# Altium schematic sheet Sheet1.SchDoc
size A
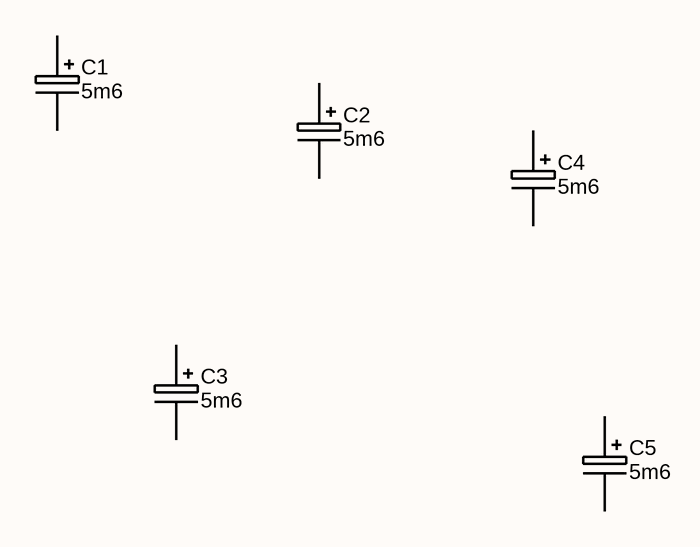
[diagram p0: Sheet1.SchDoc]

## Parts
C1  5m6  [CAPE10.0MM_Rad_30x45mm]
C2  5m6  [CAPE10.0MM_Rad_30x45mm]
C3  5m6  [CAPE10.0MM_Rad_30x45mm]
C4  5m6  [CAPE10.0MM_Rad_30x45mm]
C5  5m6  [CAPE10.0MM_Rad_30x45mm]

## Nets

Not connected (* = marked no-connect by the designer): C1 1 2; C2 1 2; C3 1 2; C4 1 2; C5 1 2

## Library data of the parts
C1-C5 = CAPE_5m6_THT_80V: Capacitor THT Electrolytic 5600uF 20% 80V; Manufacturer 1: Panasonic - ECG; Manufacturer Part Number 1: ECO-S1KP562DA; Material: Aluminum Electrolytic; SCDType: undef; Package / Case: 30.00mm Dia x 45.00mm H; Ratings: 80V; Tolerance: ±20%; Supplier 1: Digi-Key; Supplier Part Number 1: P7374-ND; Value: 5m6